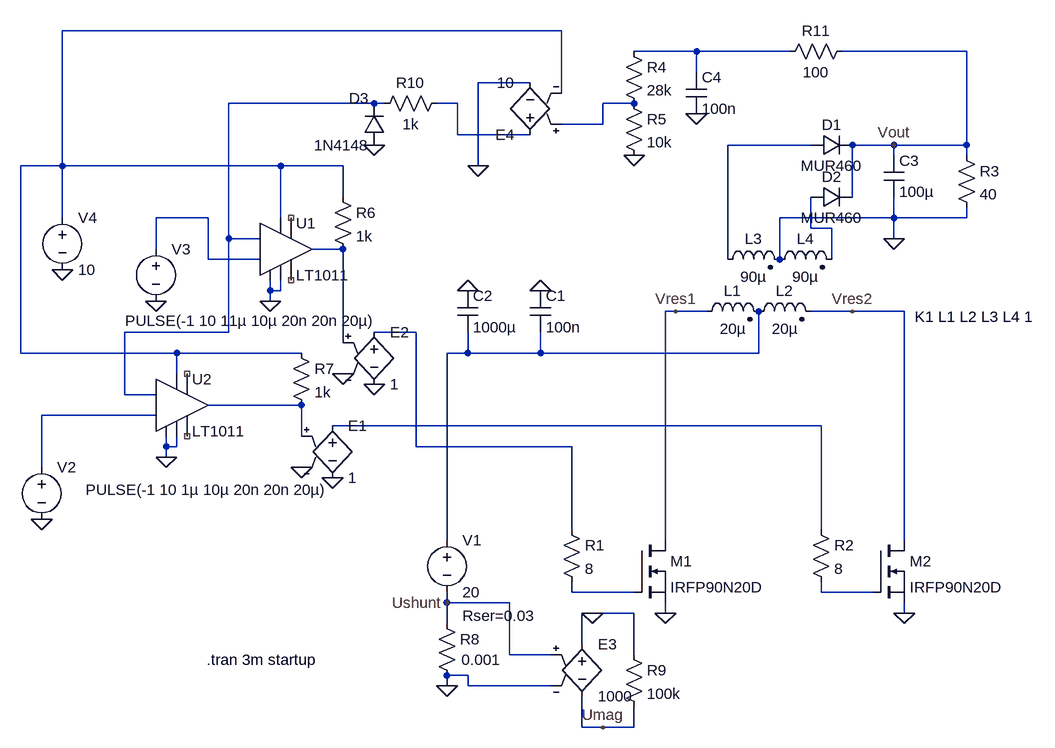
[diagram p0: schematic Draft2.asc]
Draft2.asc, the LTspice schematic file:
Version 4
SHEET 1 1092 680
WIRE 16 -640 -752 -640
WIRE 224 -608 128 -608
WIRE 368 -608 224 -608
WIRE 640 -608 448 -608
WIRE 224 -576 224 -608
WIRE -32 -560 -112 -560
WIRE 16 -544 16 -640
WIRE -272 -528 -496 -528
WIRE -256 -528 -272 -528
WIRE -144 -528 -176 -528
WIRE 128 -528 80 -528
WIRE 80 -496 80 -528
WIRE 80 -496 16 -496
WIRE -144 -480 -144 -528
WIRE -32 -480 -144 -480
WIRE 400 -464 272 -464
WIRE 528 -464 464 -464
WIRE 640 -464 640 -608
WIRE 640 -464 528 -464
WIRE 528 -448 528 -464
WIRE 640 -448 640 -464
WIRE -752 -432 -752 -640
WIRE -752 -432 -816 -432
WIRE -416 -432 -752 -432
WIRE -320 -432 -416 -432
WIRE -112 -432 -112 -560
WIRE -320 -384 -320 -432
WIRE 464 -384 464 -464
WIRE -752 -352 -752 -432
WIRE -528 -352 -608 -352
WIRE -416 -352 -416 -432
WIRE 528 -352 528 -384
WIRE 528 -352 352 -352
WIRE 640 -352 640 -368
WIRE 640 -352 528 -352
WIRE 400 -336 400 -384
WIRE 432 -336 400 -336
WIRE -496 -320 -496 -528
WIRE -448 -320 -496 -320
WIRE 528 -320 528 -352
WIRE -608 -304 -608 -352
WIRE -320 -304 -368 -304
WIRE -528 -288 -528 -352
WIRE -448 -288 -528 -288
WIRE 272 -288 272 -464
WIRE 352 -288 352 -352
WIRE 432 -288 432 -336
WIRE -432 -240 -432 -256
WIRE -416 -240 -416 -256
WIRE -416 -240 -432 -240
WIRE -432 -224 -432 -240
WIRE 192 -208 176 -208
WIRE 240 -208 192 -208
WIRE 464 -208 400 -208
WIRE 544 -208 464 -208
WIRE -496 -176 -496 -320
WIRE -496 -176 -656 -176
WIRE -208 -176 -272 -176
WIRE -320 -160 -320 -304
WIRE -816 -144 -816 -432
WIRE -576 -144 -816 -144
WIRE -384 -144 -576 -144
WIRE -128 -144 -128 -176
WIRE -128 -144 -160 -144
WIRE -16 -144 -16 -176
WIRE -16 -144 -128 -144
WIRE 320 -144 320 -208
WIRE 320 -144 -16 -144
WIRE -576 -112 -576 -144
WIRE -656 -80 -656 -176
WIRE -608 -80 -656 -80
WIRE -384 -64 -528 -64
WIRE -608 -48 -784 -48
WIRE 416 -32 -336 -32
WIRE -384 -16 -384 -64
WIRE -592 0 -592 -16
WIRE -576 0 -576 -16
WIRE -576 0 -592 0
WIRE -208 0 -208 -176
WIRE 32 0 -208 0
WIRE -592 16 -592 0
WIRE -784 32 -784 -48
WIRE 32 128 32 0
WIRE 416 128 416 -32
WIRE -160 144 -160 -144
WIRE 176 144 176 -208
WIRE 544 144 544 -208
WIRE 32 224 32 208
WIRE 128 224 32 224
WIRE 416 224 416 208
WIRE 496 224 416 224
WIRE -160 240 -160 224
WIRE -64 240 -160 240
WIRE 64 256 48 256
WIRE 128 256 64 256
WIRE 176 256 176 240
WIRE 544 256 544 240
WIRE -160 272 -160 240
WIRE 48 304 48 256
WIRE -64 320 -64 240
WIRE 0 320 -64 320
WIRE 128 320 128 256
WIRE -128 352 -160 352
WIRE -160 368 -160 352
WIRE -128 368 -128 352
WIRE 0 368 -128 368
WIRE 48 432 48 384
WIRE 80 432 48 432
WIRE 128 432 128 400
WIRE 128 432 80 432
FLAG 192 -208 Vres1
FLAG 464 -208 Vres2
FLAG -784 112 0
FLAG 528 -320 0
FLAG 528 -464 Vout
FLAG -16 -240 0
FLAG -128 -240 0
FLAG -608 -224 0
FLAG -432 -224 0
FLAG -752 -272 0
FLAG -592 16 0
FLAG 128 -448 0
FLAG -336 48 0
FLAG -384 32 0
FLAG -272 -96 0
FLAG -320 -112 0
FLAG -160 368 0
FLAG -160 240 Ushunt
FLAG 64 256 0
FLAG 80 432 Umag
FLAG -112 -432 0
FLAG -272 -464 0
FLAG 224 -512 0
FLAG 176 256 0
FLAG 544 256 0
SYMBOL nmos 128 144 R0
SYMATTR InstName M1
SYMATTR Value IRFP90N20D
SYMBOL nmos 496 144 R0
SYMATTR InstName M2
SYMATTR Value IRFP90N20D
SYMBOL voltage -160 128 R0
WINDOW 123 0 0 Left 0
WINDOW 39 24 132 Left 0
SYMATTR InstName V1
SYMATTR Value 20
SYMATTR SpiceLine Rser=0.03
SYMBOL res 16 112 R0
SYMATTR InstName R1
SYMATTR Value 8
SYMBOL res 400 112 R0
SYMATTR InstName R2
SYMATTR Value 8
SYMBOL ind2 224 -192 R270
WINDOW 0 32 56 VTop 0
WINDOW 3 5 56 VBottom 0
SYMATTR InstName L1
SYMATTR Value 20µ
SYMATTR Type ind
SYMATTR SpiceLine Rser=0.1
SYMBOL ind2 304 -192 R270
WINDOW 0 32 56 VTop 0
WINDOW 3 5 56 VBottom 0
SYMATTR InstName L2
SYMATTR Value 20µ
SYMATTR Type ind
SYMATTR SpiceLine Rser=0.1
SYMBOL ind2 256 -272 R270
WINDOW 0 32 56 VTop 0
WINDOW 3 5 56 VBottom 0
SYMATTR InstName L3
SYMATTR Value 90µ
SYMATTR Type ind
SYMATTR SpiceLine Rser=0.08
SYMBOL voltage -784 16 R0
WINDOW 3 68 50 Left 0
WINDOW 123 0 0 Left 0
WINDOW 39 0 0 Left 0
SYMATTR InstName V2
SYMATTR Value PULSE(-1 10 1µ 10µ 20n 20n 20µ)
SYMBOL diode 400 -448 R270
WINDOW 0 32 32 VTop 0
WINDOW 3 0 32 VBottom 0
SYMATTR InstName D1
SYMATTR Value MUR460
SYMBOL diode 400 -368 R270
WINDOW 0 32 32 VTop 0
WINDOW 3 0 32 VBottom 0
SYMATTR InstName D2
SYMATTR Value MUR460
SYMBOL ind2 336 -272 R270
WINDOW 0 32 56 VTop 0
WINDOW 3 5 56 VBottom 0
SYMATTR InstName L4
SYMATTR Value 90µ
SYMATTR Type ind
SYMATTR SpiceLine Rser=0.08
SYMBOL cap 512 -448 R0
SYMATTR InstName C3
SYMATTR Value 100µ
SYMATTR SpiceLine Rser=0.09
SYMBOL res 624 -464 R0
SYMATTR InstName R3
SYMATTR Value 40
SYMBOL cap -32 -240 R0
SYMATTR InstName C1
SYMATTR Value 100n
SYMATTR SpiceLine Rser=0.001 Lser=10n
SYMBOL cap -144 -240 R0
SYMATTR InstName C2
SYMATTR Value 1000µ
SYMATTR SpiceLine Rser=0.003
SYMBOL voltage -608 -320 R0
WINDOW 3 -47 126 Left 0
WINDOW 123 0 0 Left 0
WINDOW 39 0 0 Left 0
SYMATTR InstName V3
SYMATTR Value PULSE(-1 10 11µ 10µ 20n 20n 20µ)
SYMBOL Comparators\\LT1011 -416 -304 R0
SYMATTR InstName U1
SYMBOL voltage -752 -368 R0
WINDOW 123 0 0 Left 0
WINDOW 39 0 0 Left 0
SYMATTR InstName V4
SYMATTR Value 10
SYMBOL Comparators\\LT1011 -576 -64 R0
SYMATTR InstName U2
SYMBOL res 112 -624 R0
SYMATTR InstName R4
SYMATTR Value 28k
SYMBOL res 112 -544 R0
SYMATTR InstName R5
SYMATTR Value 10k
SYMBOL e -336 -48 R0
SYMATTR InstName E1
SYMATTR Value 1
SYMBOL e -272 -192 R0
SYMATTR InstName E2
SYMATTR Value 1
SYMBOL res -336 -400 R0
SYMATTR InstName R6
SYMATTR Value 1k
SYMBOL res -400 -160 R0
SYMATTR InstName R7
SYMATTR Value 1k
SYMBOL res -176 256 R0
WINDOW 3 38 72 Left 0
SYMATTR InstName R8
SYMATTR Value 0.001
SYMBOL e 48 288 R0
SYMATTR InstName E3
SYMATTR Value 1000
SYMBOL res 112 304 R0
SYMATTR InstName R9
SYMATTR Value 100k
SYMBOL e -32 -464 R180
SYMATTR InstName E4
SYMATTR Value 10
SYMBOL diode -256 -464 R180
WINDOW 0 24 72 Left 0
WINDOW 3 24 0 Left 0
SYMATTR InstName D3
SYMATTR Value 1N4148
SYMBOL res -160 -544 R90
WINDOW 0 0 56 VBottom 0
WINDOW 3 32 56 VTop 0
SYMATTR InstName R10
SYMATTR Value 1k
SYMBOL cap 208 -576 R0
SYMATTR InstName C4
SYMATTR Value 100n
SYMATTR SpiceLine Rser=0.001 Lser=10n
SYMBOL res 464 -624 R90
WINDOW 0 0 56 VBottom 0
WINDOW 3 32 56 VTop 0
SYMATTR InstName R11
SYMATTR Value 100
TEXT 560 -200 Left 0 !K1 L1 L2 L3 L4 1
TEXT -530 328 Left 0 !.tran 3m startup

The netlist it stands for:
* Draft2.asc
M1 Vres1 N015 0 0 IRFP90N20D
M2 Vres2 N016 0 0 IRFP90N20D
V1 N011 Ushunt 20 Rser=0.03
R1 N010 N015 8
R2 N014 N016 8
L1 Vres1 N011 20µ Rser=0.1
L2 N011 Vres2 20µ Rser=0.1
L3 N006 0 90µ Rser=0.08
V2 N013 0 PULSE(-1 10 1µ 10µ 20n 20n 20µ)
D1 N006 Vout MUR460
D2 N008 Vout MUR460
L4 0 N008 90µ Rser=0.08
C3 Vout 0 100µ Rser=0.09
R3 Vout 0 40
C1 0 N011 100n Rser=0.001 Lser=10n
C2 0 N011 1000µ Rser=0.003
V3 N007 0 PULSE(-1 10 11µ 10µ 20n 20n 20µ)
XU1 0 N007 N003 0 NC_01 NC_02 N009 N001 LT1011
V4 N001 0 10
XU2 0 N013 N003 0 NC_03 NC_04 N012 N001 LT1011
R4 N002 N005 28k
R5 N005 0 10k
E1 N014 0 N012 0 1
E2 N010 0 N009 0 1
R6 N001 N009 1k
R7 N001 N012 1k
R8 Ushunt 0 0.001
E3 0 Umag Ushunt 0 1000
R9 0 Umag 100k
E4 N004 0 N005 N001 10
D3 0 N003 1N4148
R10 N004 N003 1k
C4 N002 0 100n Rser=0.001 Lser=10n
R11 Vout N002 100
.model D D
.lib standard.dio
.model NMOS NMOS
.model PMOS PMOS
.lib standard.mos
K1 L1 L2 L3 L4 1
.tran 3m startup
.lib LTC1.lib
.backanno
.end